# Altium schematic sheet Sheet1.SchDoc
size A4
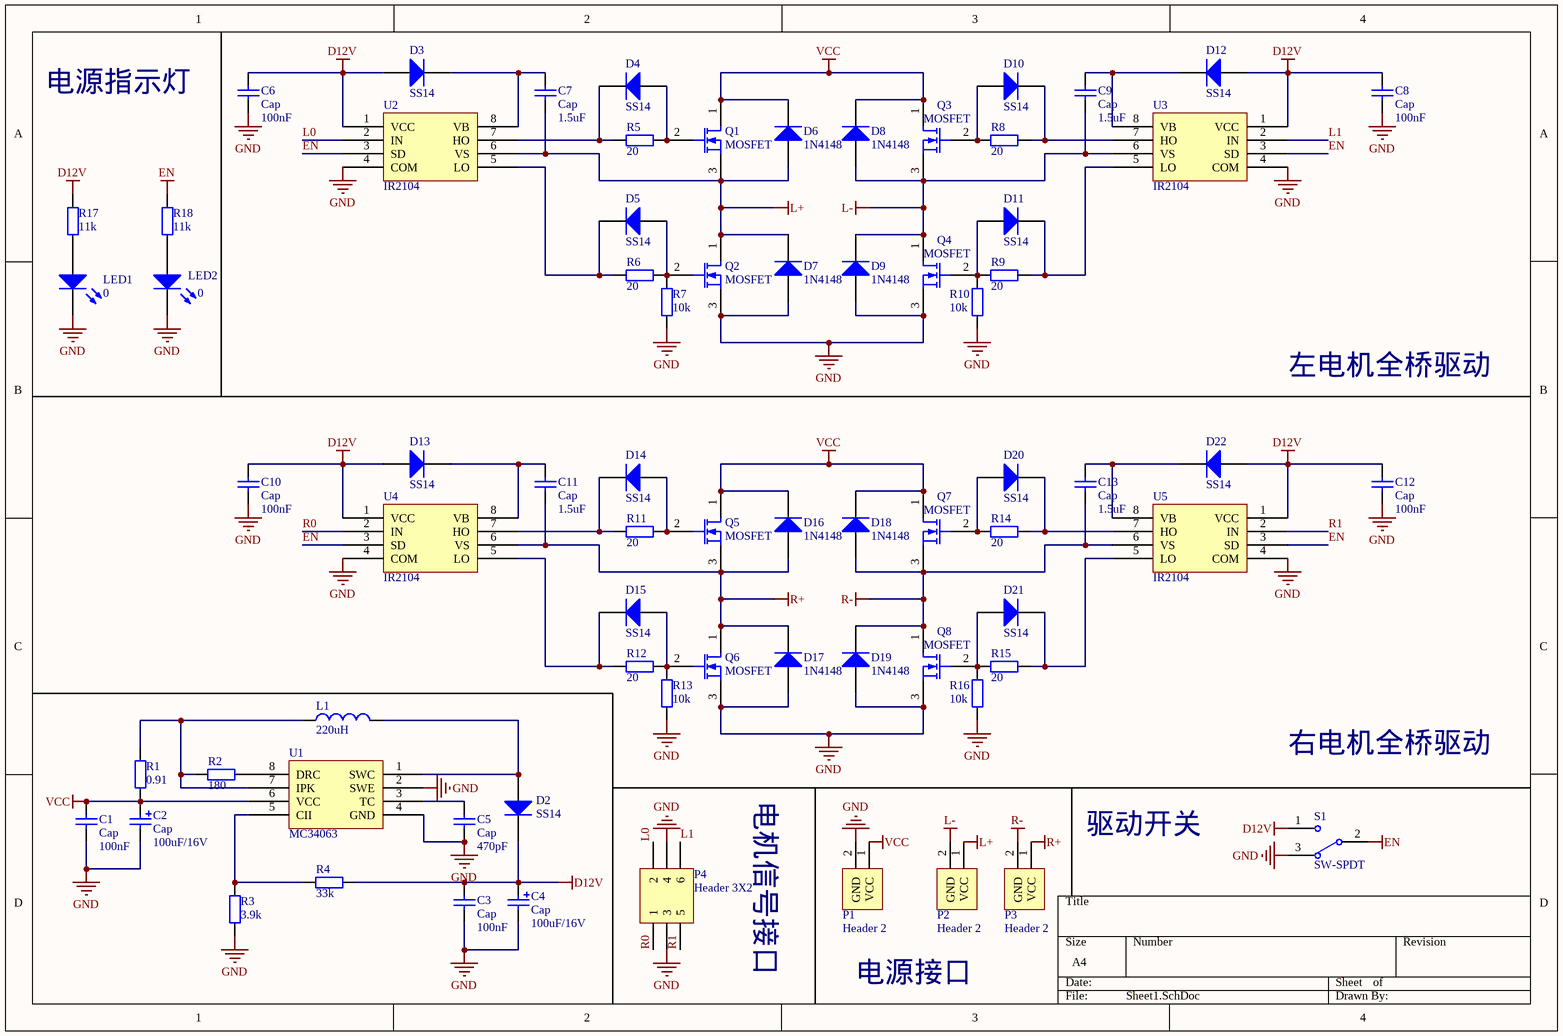
[diagram p0: Sheet1.SchDoc]

## Parts
C1  Cap  value 100nF  [0603C]
C2  Cap  value 100uF/16V  [电解电容]
C3  Cap  value 100nF  [0603C]
C4  Cap  value 100uF/16V  [电解电容]
C5  Cap  value 470pF  [0603C]
C6  Cap  value 100nF  [0603C]
C7  Cap  value 1.5uF  [0603C]
C8  Cap  value 100nF  [0603C]
C9  Cap  value 1.5uF  [0603C]
C10  Cap  value 100nF  [0603C]
C11  Cap  value 1.5uF  [0603C]
C12  Cap  value 100nF  [0603C]
C13  Cap  value 1.5uF  [0603C]
D2  SS14  [ss54]
D3  SS14  [ss54]
D4  SS14  [ss54]
D5  SS14  [ss54]
D6  1N4148  [SOD123]
D7  1N4148  [SOD123]
D8  1N4148  [SOD123]
D9  1N4148  [SOD123]
D10  SS14  [ss54]
D11  SS14  [ss54]
D12  SS14  [ss54]
D13  SS14  [ss54]
D14  SS14  [ss54]
D15  SS14  [ss54]
D16  1N4148  [SOD123]
D17  1N4148  [SOD123]
D18  1N4148  [SOD123]
D19  1N4148  [SOD123]
D20  SS14  [ss54]
D21  SS14  [ss54]
D22  SS14  [ss54]
L1  220uH  [cd54]
LED1  0  [0603C]
LED2  0  [0603C]
P1  Header 2  [VCCBAT]
P2  Header 2  [VCCBAT]
P3  Header 2  [VCCBAT]
P4  Header 3X2  [HDR2X3]
Q1  MOSFET  [DPAK-1]
Q2  MOSFET  [DPAK-1]
Q3  MOSFET  [DPAK-1]
Q4  MOSFET  [DPAK-1]
Q5  MOSFET  [DPAK-1]
Q6  MOSFET  [DPAK-1]
Q7  MOSFET  [DPAK-1]
Q8  MOSFET  [DPAK-1]
R1  value 0.91  [0603R]  (hidden comment: Res2)
R2  value 180  [0603R]  (hidden comment: Res2)
R3  value 3.9k  [0603R]  (hidden comment: Res2)
R4  value 33k  [0603R]  (hidden comment: Res2)
R5  value 20  [0603R]  (hidden comment: Res2)
R6  value 20  [0603R]  (hidden comment: Res2)
R7  value 10k  [0603R]  (hidden comment: Res2)
R8  value 20  [0603R]  (hidden comment: Res2)
R9  value 20  [0603R]  (hidden comment: Res2)
R10  value 10k  [0603R]  (hidden comment: Res2)
R11  value 20  [0603R]  (hidden comment: Res2)
R12  value 20  [0603R]  (hidden comment: Res2)
R13  value 10k  [0603R]  (hidden comment: Res2)
R14  value 20  [0603R]  (hidden comment: Res2)
R15  value 20  [0603R]  (hidden comment: Res2)
R16  value 10k  [0603R]  (hidden comment: Res2)
R17  value 11k  [0603R]  (hidden comment: Res2)
R18  value 11k  [0603R]  (hidden comment: Res2)
S1  SW-SPDT  [SW]
U1  MC34063  [SOIC-8]
U2  IR2104  [SOIC-8]
U3  IR2104  [SOIC-8]
U4  IR2104  [SOIC-8]
U5  IR2104  [SOIC-8]

## Nets
D12V: C3.2 C4.1 C6.2 C8.2 C10.2 C12.2 D2.2(K) D3.1(A) D12.1(A) D13.1(A) D22.1(A) R4.1 R17.2 S1.1 U2.1(VCC) U3.1(VCC) U4.1(VCC) U5.1(VCC)
EN: R18.2 S1.2 U2.3(SD) U3.3(SD) U4.3(SD) U5.3(SD)
GND: C1.1 C2.2 C3.1 C4.2 C5.1 C6.1 C8.1 C10.1 C12.1 D7.1(A) D9.1(A) D17.1(A) D19.1(A) LED1.2(K) LED2.2(K) P1.2(GND) P4.3 P4.4 Q2.3 Q4.3 Q6.3 Q8.3 R3.2 R7.1 R10.1 R13.1 R16.1 S1.3 U1.2(SWE) U1.4(GND) U2.4(COM) U3.4(COM) U4.4(COM) U5.4(COM)
L+: C7.1 D6.1(A) D7.2(K) P2.1(VCC) Q1.3 Q2.1(D) U2.6(VS)
L-: C9.1 D8.1(A) D9.2(K) P2.2(GND) Q3.3 Q4.1(D) U3.6(VS)
R+: C11.1 D16.1(A) D17.2(K) P3.1(VCC) Q5.3 Q6.1(D) U4.6(VS)
R-: C13.1 D18.1(A) D19.2(K) P3.2(GND) Q7.3 Q8.1(D) U5.6(VS)
VCC: C1.2 C2.1 D6.2(K) D8.2(K) D16.2(K) D18.2(K) P1.1(VCC) Q1.1(D) Q3.1(D) Q5.1(D) Q7.1(D) R1.1 U1.6(VCC)
L0: P4.2 U2.2(IN)
L1: P4.6 U3.2(IN)
R0: P4.1 U4.2(IN)
R1: P4.5 U5.2(IN)
NetC5_2: C5.2 U1.3(TC)
NetC7_2: C7.2 D3.2(K) U2.8(VB)
NetC9_2: C9.2 D12.2(K) U3.8(VB)
NetC11_2: C11.2 D13.2(K) U4.8(VB)
NetC13_2: C13.2 D22.2(K) U5.8(VB)
NetD2_1: D2.1(A) L1.2 U1.1(SWC)
NetD4_1: D4.1(A) Q1.2(G) R5.1
NetD4_2: D4.2(K) R5.2 U2.7(HO)
NetD5_1: D5.1(A) Q2.2(G) R6.1 R7.2
NetD5_2: D5.2(K) R6.2 U2.5(LO)
NetD10_1: D10.1(A) Q3.2(G) R8.1
NetD10_2: D10.2(K) R8.2 U3.7(HO)
NetD11_1: D11.1(A) Q4.2(G) R9.1 R10.2
NetD11_2: D11.2(K) R9.2 U3.5(LO)
NetD14_1: D14.1(A) Q5.2(G) R11.1
NetD14_2: D14.2(K) R11.2 U4.7(HO)
NetD15_1: D15.1(A) Q6.2(G) R12.1 R13.2
NetD15_2: D15.2(K) R12.2 U4.5(LO)
NetD20_1: D20.1(A) Q7.2(G) R14.1
NetD20_2: D20.2(K) R14.2 U5.7(HO)
NetD21_1: D21.1(A) Q8.2(G) R15.1 R16.2
NetD21_2: D21.2(K) R15.2 U5.5(LO)
NetL1_1: L1.1 R1.2 R2.2 U1.7(IPK)
NetLED1_1: LED1.1(A) R17.1
NetLED2_1: LED2.1(A) R18.1
NetR2_1: R2.1 U1.8(DRC)
NetR3_1: R3.1 R4.2 U1.5(CII)

## Notes on the sheet
- 电源指示灯
- 左电机全桥驱动
- 右电机全桥驱动
- 电机信号接口
- 驱动开关
- 电源接口

## Library data of the parts
C1 C3 C5-C13 = Cap: Capacitor; Published: 8-Jun-2000; LatestRevisionDate: 17-Jul-2002; LatestRevisionNote: Re-released for DXP Platform.; PackageReference: RAD-0.3; Publisher: Altium Limited; PackageDescription: Radial Cap, Thru-Hole; 2 Leads; 0.3 in Pin Spacing
C2 C4 = Cap2: Capacitor; Published: 8-Jun-2000; LatestRevisionDate: 17-Jul-2002; LatestRevisionNote: Re-released for DXP Platform.; PackageReference: RAD-0.3; Publisher: Altium Limited; PackageDescription: Radial Cap, Thru-Hole; 2 Leads; 0.3 in Pin Spacing
D2-D5 D10-D15 D20-D22 = Diode_1: Default Diode; Published: 8-Jun-2000; LatestRevisionDate: 17-Jul-2002; LatestRevisionNote: Re-released for DXP Platform.; PackageVersion: Sep-1996; PackageReference: SMC; Publisher: Altium Limited; PackageDescription: DO-214-AB/SMC; 2 C-Bend Leads; Body 7.9 x 5.9 mm, inc. leads (LxW); Code_JEDEC: DO-214-AB
D6-D9 D16-D19 = Diode_2: Default Diode; Published: 8-Jun-2000; LatestRevisionDate: 17-Jul-2002; LatestRevisionNote: Re-released for DXP Platform.; PackageVersion: Sep-1996; PackageReference: SMC; Publisher: Altium Limited; PackageDescription: DO-214-AB/SMC; 2 C-Bend Leads; Body 7.9 x 5.9 mm, inc. leads (LxW); Code_JEDEC: DO-214-AB
L1 = Inductor_2: Inductor; Code_IEC: 1005; Published: 8-Jun-2000; LatestRevisionDate: 29-May-2009; LatestRevisionNote: IPC-7351 Footprint Added.; PackageReference: 0402-A; Publisher: Altium Limited; PackageDescription: Chip Inductor; Code_JEITA: 0402
LED1 LED2 = LED2: Typical RED, GREEN, YELLOW, AMBER GaAs LED; Published: 8-Jun-2000; LatestRevisionDate: 17-Jul-2002; LatestRevisionNote: Re-released for DXP Platform.; PackageVersion: Feb-2002; PackageReference: 3.2X1.6X1.1; Publisher: Altium Limited; PackageDescription: SM LED; 2 Flat Leads
P1-P3 = Header 2_2: Header, 2-Pin; LatestRevisionDate: 17-Jul-2002; LatestRevisionNote: Re-released for DXP Platform.; Publisher: Altium Limited
P4 = Header 3X2: Header, 3-Pin, Dual row; LatestRevisionDate: 17-Jul-2002; LatestRevisionNote: Re-released for DXP Platform.; Publisher: Altium Limited
Q1-Q8 = MOSFET-N
R1-R18 = Res2: Resistor; Published: 8-Jun-2000; LatestRevisionDate: 17-Jul-2002; LatestRevisionNote: Re-released for DXP Platform.; PackageReference: AXIAL-0.4; Publisher: Altium Limited; PackageDescription: Axial Device, Thru-Hole; 2 Leads; 0.4 in Pin Spacing
S1 = SW-SPDT: SPDT Subminiature Toggle Switch, Right Angle Mounting, Vertical Actuation; Published: 24-Mar-1999; LatestRevisionDate: 17-Dec-2003; LatestRevisionNote: Schematic revised, PCB Footprint replaced.; DatasheetVersion: 05-Dec-2000; PackageReference: TL36WW15050; Publisher: Altium Limited; PackageDescription: Switch; 4 Leads; ComponentLink1Description: Manufacturer Link; ComponentLink1URL: http://www.apem.com